# Altium schematic sheet CHANGE_FMU3_REV_D.SchDoc: Pixhawk_mini_8L.sch
size A4; Date: 18/08/2014 1:53:31 PM; DrawnBy: Philip Rowse; SheetNumber: 10; SheetTotal: 10
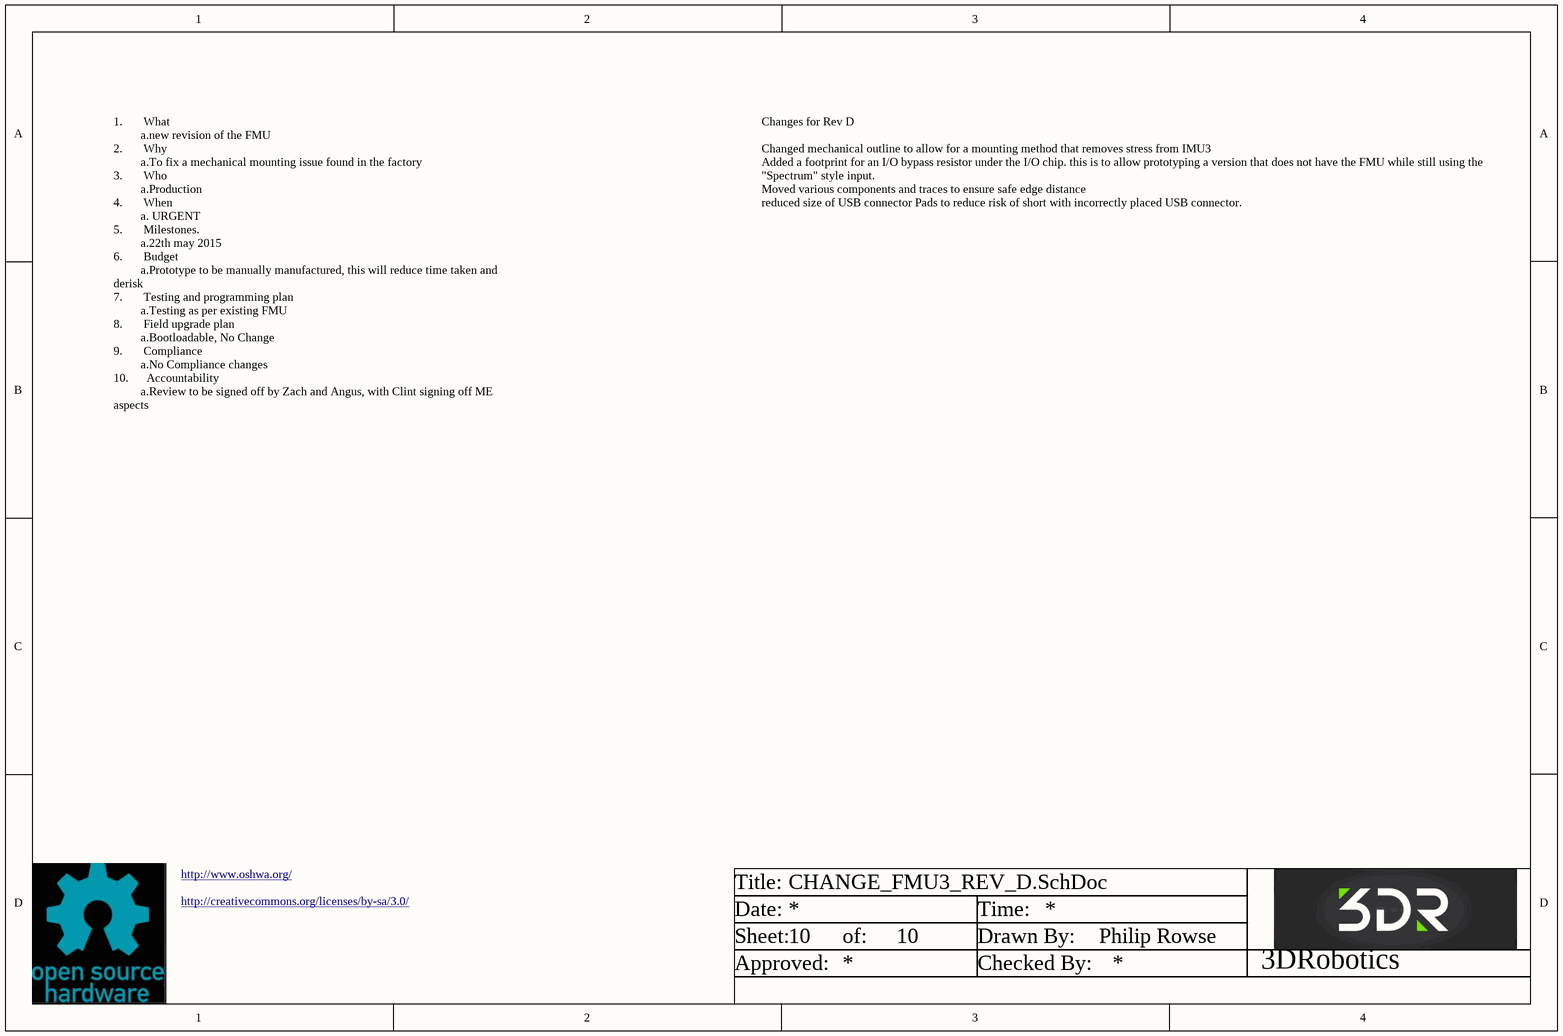
[diagram p0: CHANGE_FMU3_REV_D.SchDoc]

## Notes on the sheet
- Changes for Rev D
  Changed mechanical outline to allow for a mounting method that removes stress from IMU3
  Added a footprint for an I/O bypass resistor under the I/O chip. this is to allow prototyping a version that does not have the FMU while still using the "Spectrum" style input.
  Moved various components and traces to ensure safe edge distance
  reduced size of USB connector Pads to reduce risk of short with incorrectly placed USB connector.
- 1.       What
  a.new revision of the FMU
  2.       Why
  a.To fix a mechanical mounting issue found in the factory
  3.       Who
  a.Production
  4.       When
  a. URGENT
  5.       Milestones.
  a.22th may 2015
  6.       Budget
  a.Prototype to be manually manufactured, this will reduce time taken and derisk
  7.       Testing and programming plan
  a.Testing as per existing FMU
  8.       Field upgrade plan
  a.Bootloadable, No Change
  9.       Compliance
  a.No Compliance changes
  10.      Accountability
  a.Review to be signed off by Zach and Angus, with Clint signing off ME aspects
- http://www.oshwa.org/
- http://creativecommons.org/licenses/by-sa/3.0/
- Title:
- Date:
- Time:
- Sheet:
- Approved:
- of:
- Drawn By:
- Checked By:
- 3DRobotics